# Altium schematic sheet ui_ux6.SchDoc: mcHF QRP Transceiver UI board
size A4; Author: K Atanassov; CompanyName: M0NKA; Revision: 0.6.3; SheetTotal: 5
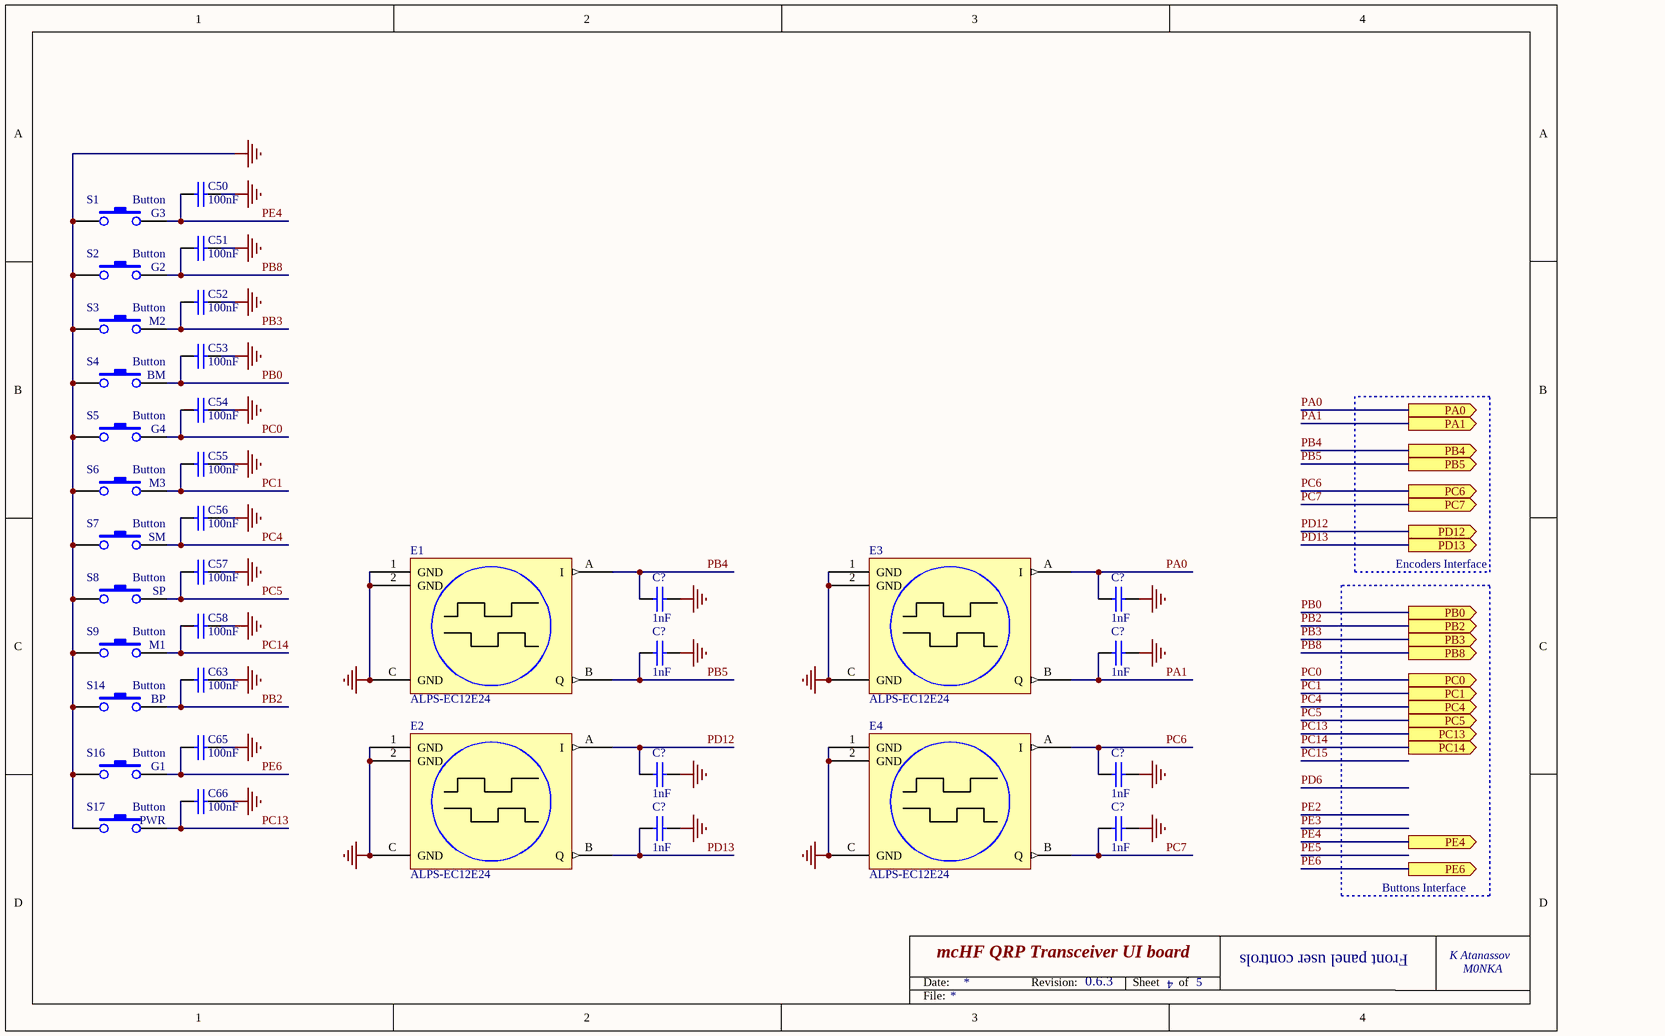
[diagram p0: ui_ux6.SchDoc]

## Parts
(Parts that share a designator on the sheet are numbered #1, #2 ... from top to bottom, then left to right.)
C50  100nF  [0805-Pro]
C51  100nF  [0805-Pro]
C52  100nF  [0805-Pro]
C53  100nF  [0805-Pro]
C54  100nF  [0805-Pro]
C55  100nF  [0805-Pro]
C56  100nF  [0805-Pro]
C57  100nF  [0805-Pro]
C58  100nF  [0805-Pro]
C63  100nF  [0805-Pro]
C65  100nF  [0805-Pro]
C66  100nF  [0805-Pro]
C?#1  1nF  [0805-Pro]
C?#2  1nF  [0805-Pro]
C?#3  1nF  [0805-Pro]
C?#4  1nF  [0805-Pro]
C?#5  1nF  [0805-Pro]
C?#6  1nF  [0805-Pro]
C?#7  1nF  [0805-Pro]
C?#8  1nF  [0805-Pro]
E1  ALPS-EC12E24  [Encoder]
E2  ALPS-EC12E24  [Encoder]
E3  ALPS-EC12E24  [Encoder]
E4  ALPS-EC12E24  [Encoder]
S1  Button  Software function: G3  [BUTTON_SMD2]
S2  Button  Software function: G2  [BUTTON_SMD2]
S3  Button  Software function: M2  [BUTTON_SMD2]
S4  Button  Software function: BM  [BUTTON_SMD2]
S5  Button  Software function: G4  [BUTTON_SMD2]
S6  Button  Software function: M3  [BUTTON_SMD2]
S7  Button  Software function: SM  [BUTTON_SMD2]
S8  Button  Software function: SP  [BUTTON_SMD2]
S9  Button  Software function: M1  [BUTTON_SMD2]
S14  Button  Software function: BP  [BUTTON_SMD2]
S16  Button  Software function: G1  [BUTTON_SMD2]
S17  Button  Software function: PWR  [BUTTON_SMD2]

## Ports
PA0 (out), PA1 (out), PB0 (out), PB2 (out), PB3 (out), PB4 (out), PB5 (out), PB8 (out), PC0 (out), PC1 (out), PC4 (out), PC5 (out), PC6 (out), PC7 (out), PC13 (out), PC14 (out), PD12 (out), PD13 (out), PE4 (out), PE6 (out)

## Nets
GND: C50.1 C51.1 C52.1 C53.1 C54.1 C55.1 C56.1 C57.1 C58.1 C63.1 C65.1 C66.1 C?#1.2 C?#2.2 C?#3.2 C?#4.2 C?#5.2 C?#6.2 C?#7.2 C?#8.2 E1.1(GND) E1.2(GND) E1.C(GND) E2.1(GND) E2.2(GND) E2.C(GND) E3.1(GND) E3.2(GND) E3.C(GND) E4.1(GND) E4.2(GND) E4.C(GND) S1.1 S2.1 S3.1 S4.1 S5.1 S6.1 S7.1 S8.1 S9.1 S14.1 S16.1 S17.1
PA0: C?#2.1 E3.A(I) ; port PA0
PA1: C?#4.1 E3.B(Q) ; port PA1
PB0: C53.2 S4.2 ; port PB0
PB2: C63.2 S14.2 ; port PB2
PB3: C52.2 S3.2 ; port PB3
PB4: C?#1.1 E1.A(I) ; port PB4
PB5: C?#3.1 E1.B(Q) ; port PB5
PB8: C51.2 S2.2 ; port PB8
PC0: C54.2 S5.2 ; port PC0
PC1: C55.2 S6.2 ; port PC1
PC4: C56.2 S7.2 ; port PC4
PC5: C57.2 S8.2 ; port PC5
PC6: C?#6.1 E4.A(I) ; port PC6
PC7: C?#8.1 E4.B(Q) ; port PC7
PC13: C66.2 S17.2 ; port PC13
PC14: C58.2 S9.2 ; port PC14
PD12: C?#5.1 E2.A(I) ; port PD12
PD13: C?#7.1 E2.B(Q) ; port PD13
PE4: C50.2 S1.2 ; port PE4
PE6: C65.2 S16.2 ; port PE6

## Notes on the sheet
- Encoders Interface
- Buttons Interface
- 4
- Front panel user controls
- Date:
- Revision:
- Sheet
- of
- File:

## Library data of the parts
C50-C58 C63 C65 C66 = CAP: Capacitor; Order: FN 174-0673; QT Order: QCC-00154; Price: 0.068
C?#1-C?#8 = CAP: Capacitor; Order: FN 185-6408; QT Order: QCC-00259; Price: 0.01
E1-E4 = Encoder: ALPS Rotary Encoder; Order: FN 152-0812; Price: 1.00
S1-S9 S14 S16 S17 = SW-PB: Push Button; Order: EB 290913735944; Price: 0.14